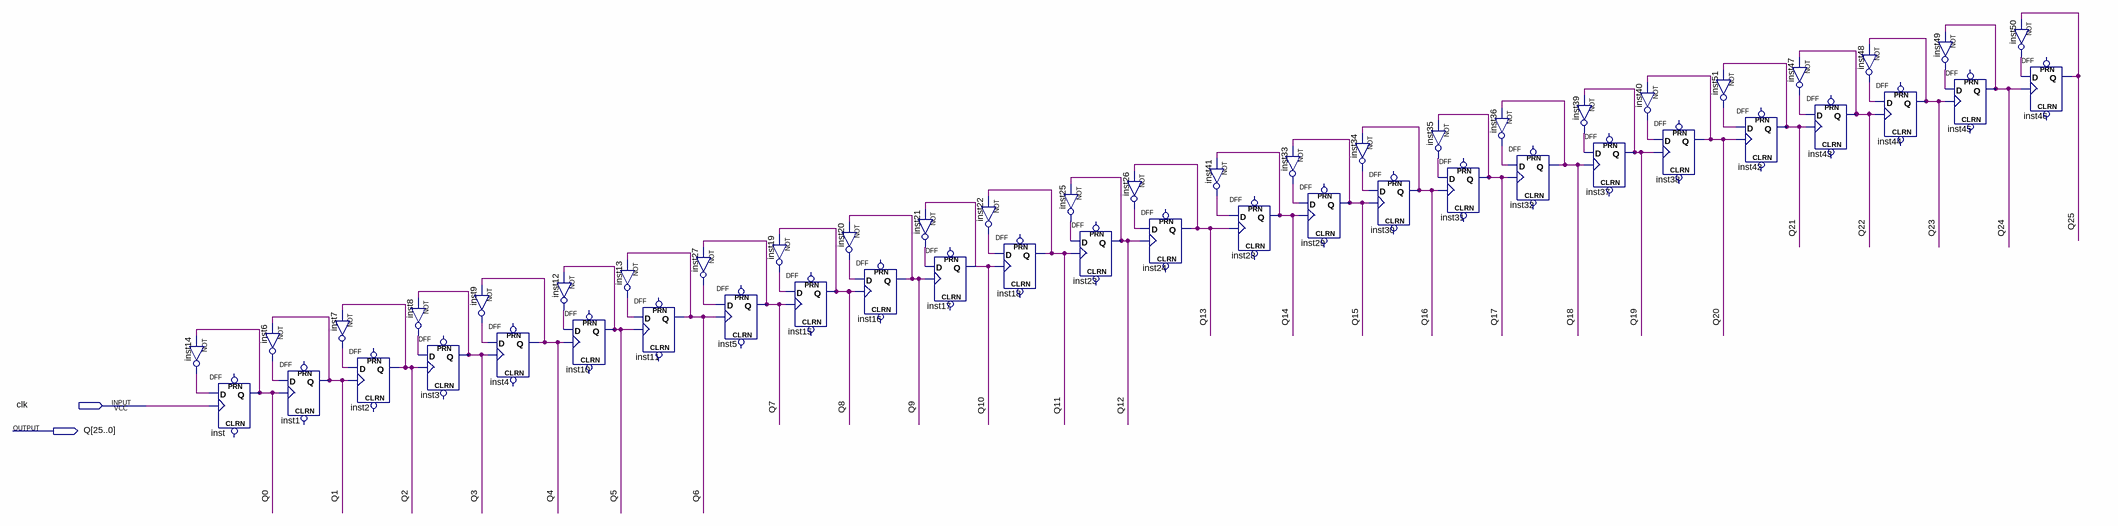
[diagram p0: schematic sheet]
// Quartus schematic DivFreq.bdf as structural Verilog: 52 symbols, 2 pins
module DivFreq (
  input  clk,
  output [25:0] Q
);

  wire inst6_out, inst7_out, inst8_out, inst9_out, inst12_out, inst13_out, inst14_out, inst19_out,
       inst20_out, inst21_out, inst22_out, inst25_out, inst26_out, inst27_out, inst33_out, inst34_out,
       inst35_out, inst36_out, inst39_out, inst40_out, inst41_out, inst47_out, inst48_out, inst49_out,
       inst50_out, inst51_out;

  not inst14 (inst14_out, Q[0]);
  DFF inst (.CLK(clk), .D(inst14_out), .Q(Q[0]));  // open: CLRN, PRN
  not inst6 (inst6_out, Q[1]);
  DFF inst1 (.CLK(Q[0]), .D(inst6_out), .Q(Q[1]));  // open: CLRN, PRN
  not inst7 (inst7_out, Q[2]);
  DFF inst2 (.CLK(Q[1]), .D(inst7_out), .Q(Q[2]));  // open: CLRN, PRN
  not inst8 (inst8_out, Q[3]);
  DFF inst3 (.CLK(Q[2]), .D(inst8_out), .Q(Q[3]));  // open: CLRN, PRN
  not inst9 (inst9_out, Q[4]);
  DFF inst4 (.CLK(Q[3]), .D(inst9_out), .Q(Q[4]));  // open: CLRN, PRN
  not inst12 (inst12_out, Q[5]);
  DFF inst10 (.CLK(Q[4]), .D(inst12_out), .Q(Q[5]));  // open: CLRN, PRN
  not inst13 (inst13_out, Q[6]);
  DFF inst11 (.CLK(Q[5]), .D(inst13_out), .Q(Q[6]));  // open: CLRN, PRN
  not inst27 (inst27_out, Q[7]);
  DFF inst5 (.CLK(Q[6]), .D(inst27_out), .Q(Q[7]));  // open: CLRN, PRN
  not inst19 (inst19_out, Q[8]);
  DFF inst15 (.CLK(Q[7]), .D(inst19_out), .Q(Q[8]));  // open: CLRN, PRN
  not inst20 (inst20_out, Q[9]);
  DFF inst16 (.CLK(Q[8]), .D(inst20_out), .Q(Q[9]));  // open: CLRN, PRN
  not inst21 (inst21_out, Q[10]);
  DFF inst17 (.CLK(Q[9]), .D(inst21_out), .Q(Q[10]));  // open: CLRN, PRN
  not inst22 (inst22_out, Q[11]);
  DFF inst18 (.CLK(Q[10]), .D(inst22_out), .Q(Q[11]));  // open: CLRN, PRN
  not inst25 (inst25_out, Q[12]);
  DFF inst23 (.CLK(Q[11]), .D(inst25_out), .Q(Q[12]));  // open: CLRN, PRN
  not inst26 (inst26_out, Q[13]);
  DFF inst24 (.CLK(Q[12]), .D(inst26_out), .Q(Q[13]));  // open: CLRN, PRN
  not inst41 (inst41_out, Q[14]);
  DFF inst28 (.CLK(Q[13]), .D(inst41_out), .Q(Q[14]));  // open: CLRN, PRN
  not inst33 (inst33_out, Q[15]);
  DFF inst29 (.CLK(Q[14]), .D(inst33_out), .Q(Q[15]));  // open: CLRN, PRN
  not inst34 (inst34_out, Q[16]);
  DFF inst30 (.CLK(Q[15]), .D(inst34_out), .Q(Q[16]));  // open: CLRN, PRN
  not inst35 (inst35_out, Q[17]);
  DFF inst31 (.CLK(Q[16]), .D(inst35_out), .Q(Q[17]));  // open: CLRN, PRN
  not inst36 (inst36_out, Q[18]);
  DFF inst32 (.CLK(Q[17]), .D(inst36_out), .Q(Q[18]));  // open: CLRN, PRN
  not inst39 (inst39_out, Q[19]);
  DFF inst37 (.CLK(Q[18]), .D(inst39_out), .Q(Q[19]));  // open: CLRN, PRN
  not inst40 (inst40_out, Q[20]);
  DFF inst38 (.CLK(Q[19]), .D(inst40_out), .Q(Q[20]));  // open: CLRN, PRN
  not inst51 (inst51_out, Q[21]);
  DFF inst42 (.CLK(Q[20]), .D(inst51_out), .Q(Q[21]));  // open: CLRN, PRN
  not inst47 (inst47_out, Q[22]);
  DFF inst43 (.CLK(Q[21]), .D(inst47_out), .Q(Q[22]));  // open: CLRN, PRN
  not inst48 (inst48_out, Q[23]);
  DFF inst44 (.CLK(Q[22]), .D(inst48_out), .Q(Q[23]));  // open: CLRN, PRN
  not inst49 (inst49_out, Q[24]);
  DFF inst45 (.CLK(Q[23]), .D(inst49_out), .Q(Q[24]));  // open: CLRN, PRN
  not inst50 (inst50_out, Q[25]);
  DFF inst46 (.CLK(Q[24]), .D(inst50_out), .Q(Q[25]));  // open: CLRN, PRN
endmodule
